# Altium schematic sheet bms_EMBEDDED_R00.SchDoc: Sistema Embebido
size A4; Author: Tobias Bavasso Piizzi; CompanyName: Introducción al Diseño de Circuitos Impresos; Organization: UTN FRBA; Revision: R00
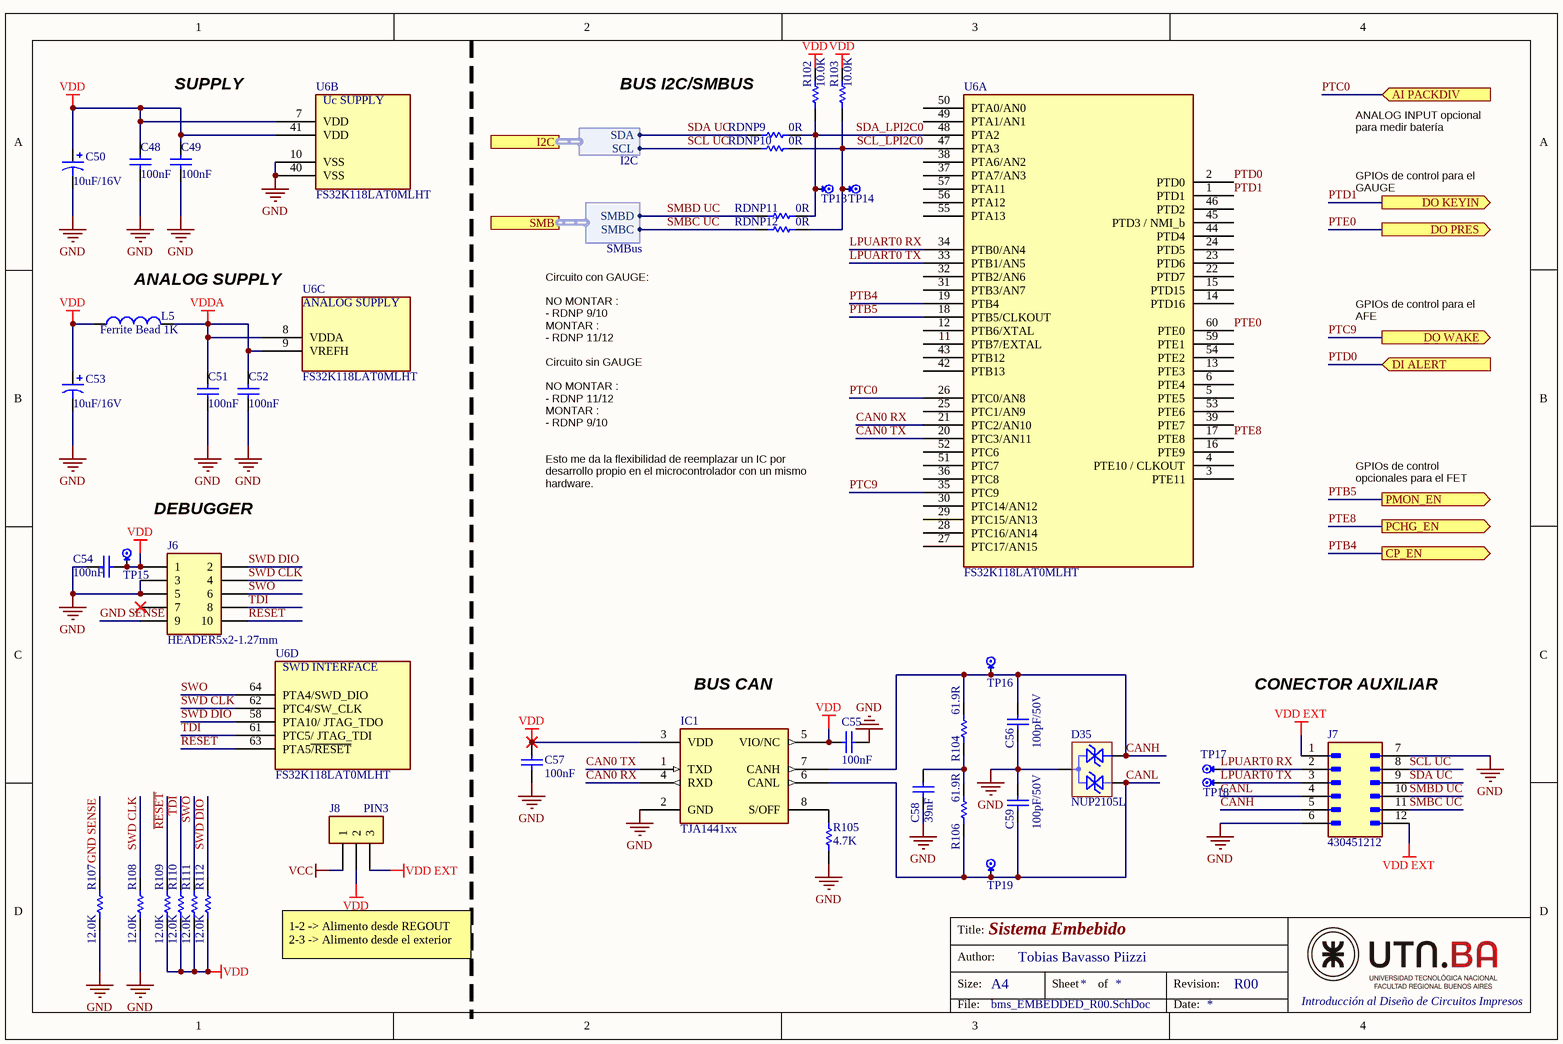
[diagram p0: bms_EMBEDDED_R00.SchDoc]

## Parts
C48  100nF  [C0603]
C49  100nF  [C0603]
C50  10uF/16V  [1206 Cap Tant]
C51  100nF  [C0603]
C52  100nF  [C0603]
C53  10uF/16V  [1206 Cap Tant]
C54  100nF  [C0603]
C55  100nF  [C0603]
C56  100pF/50V  [C0603]
C57  100nF  [C0603]
C58  39nF  [C0603]
C59  100pF/50V  [C0603]
D35  NUP2105L  [SOT-23]
IC1  TJA1441xx  [SOIC8]
J6  HEADER5x2-1.27mm  [PAD10-2X05-HH]
J7  430451212  [MOLEX_430451212]
J8  PIN3  [SIP3]
L5  Ferrite Bead 1K  [0603 FB]
R102  10.0K  [R0603]
R103  10.0K  [R0603]
R104  61.9R  [R0603]
R105  4.7K  [R0603]
R106  61.9R  [R0603]
R107  12.0K  [R0603]
R108  12.0K  [R0603]
R109  12.0K  [R0603]
R110  12.0K  [R0603]
R111  12.0K  [R0603]
R112  12.0K  [R0603]
RDNP9  0R  [R0603]
RDNP10  0R  [R0603]
RDNP11  0R  [R0603]
RDNP12  0R  [R0603]
TP13  Test Point  [TEST POINT SMD 1]  (value not drawn)
TP14  Test Point  [TEST POINT SMD 1]  (value not drawn)
TP15  Test Point  [TEST POINT SMD 1]  (value not drawn)
TP16  Test Point  [TEST POINT SMD 1]  (value not drawn)
TP17  Test Point  [TEST POINT SMD 1]  (value not drawn)
TP18  Test Point  [TEST POINT SMD 1]  (value not drawn)
TP19  Test Point  [TEST POINT SMD 1]  (value not drawn)
U6  FS32K118LAT0MLHT  [LQFP64-NXP]  (parts A,B,C,D of 4)

## Ports
AI PACKDIV (in), CP_EN (out), DI ALERT (in), DO KEYIN (out), DO PRES (out), DO WAKE (out), I2C (harness I2C), PCHG_EN (out), PMON_EN (out), SMB (harness SMBus)

## Harnesses
I2C: SDA, SCL
SMBus: SMBD, SMBC

## Nets
GND: C48.1 C49.1 C50.2 C51.1 C52.1 C53.2 C54.1 C55.1 C56.1 C57.2 C58.1 C59.2 D35.3 IC1.2(GND) J6.3 J6.5 J7.6 J7.7 R105.1 R107.2 R108.2 U6.10(VSS) U6.40(VSS)
VCC: J8.1
VDD: C48.2 C49.2 C50.1 C53.1 C54.2 C55.2 C57.1 IC1.3(VDD) IC1.5(VIO/NC) J6.1 J8.2 L5.1 R102.1 R103.1 R109.2 R110.2 R111.2 R112.2 TP15.1 U6.7(VDD) U6.41(VDD)
VDD EXT: J7.1 J7.12 J8.3
VDDA: C51.2 C52.2 L5.2 U6.8(VDDA) U6.9(VREFH)
~{RESET}: J6.10 R109.1 U6.63(PTA5~{/RESET})
CAN0 RX: IC1.4(RXD) U6.21(PTC2/AN10)
CAN0 TX: IC1.1(TXD) U6.20(PTC3/AN11)
CANH: C56.2 D35.1 IC1.7(CANH) J7.5 R104.2 TP16.1
CANL: C59.1 D35.2 IC1.6(CANL) J7.4 R106.1 TP19.1
GND SENSE: J6.9 R107.1
LPUART0 RX: J7.2 TP17.1 U6.34(PTB0/AN4)
LPUART0 TX: J7.3 TP18.1 U6.33(PTB1/AN5)
PTB4: U6.19(PTB4) ; port CP_EN
PTB5: U6.18(PTB5/CLKOUT) ; port PMON_EN
PTC0: U6.26(PTC0/AN8) ; port AI PACKDIV
PTC9: U6.35(PTC9) ; port DO WAKE
PTD0: U6.2(PTD0) ; port DI ALERT
PTD1: U6.1(PTD1) ; port DO KEYIN
PTE0: U6.60(PTE0) ; port DO PRES
PTE8: U6.17(PTE8) ; port PCHG_EN
SCL UC: J7.8 RDNP10.1 ; port I2C.SCL
SCL_LPI2C0: R103.2 RDNP10.2 RDNP12.2 TP14.1 U6.47(PTA3)
SDA UC: J7.9 RDNP9.1 ; port I2C.SDA
SDA_LPI2C0: R102.2 RDNP9.2 RDNP11.2 TP13.1 U6.48(PTA2)
SMBC UC: J7.11 RDNP12.1 ; port SMB.SMBC
SMBD UC: J7.10 RDNP11.1 ; port SMB.SMBD
SWD CLK: J6.4 R108.1 U6.62(PTC4/SW_CLK)
SWD DIO: J6.2 R112.1 U6.58(PTA10/_JTAG_TDO)
SWO: J6.6 R111.1 U6.64(PTA4/SWD_DIO)
TDI: J6.8 R110.1 U6.61(PTC5/_JTAG_TDI)
NetC58_2: C58.2 R104.1 R106.2
NetIC1_8: IC1.8(S/OFF) R105.2

Not connected (* = marked no-connect by the designer): J6 7*; U6 3(PTE11) 4(PTE10_/_CLKOUT) 5(PTE5) 6(PTE4) 11(PTB7/EXTAL) 12(PTB6/XTAL) 13(PTE3) 14(PTD16) 15(PTD15) 16(PTE9) 22(PTD7) 23(PTD6) 24(PTD5) 25(PTC1/AN9) 27(PTC17/AN15) 28(PTC16/AN14) 29(PTC15/AN13) 30(PTC14/AN12) 31(PTB3/AN7) 32(PTB2/AN6) 36(PTC8) 37(PTA7/AN3) 38(PTA6/AN2) 39(PTE7) 42(PTB13) 43(PTB12) 44(PTD4) 45(PTD3_/_NMI_b) 46(PTD2) 49(PTA1/AN1) 50(PTA0/AN0) 51(PTC7) 52(PTC6) 53(PTE6) 54(PTE2) 55(PTA13) 56(PTA12) 57(PTA11) 59(PTE1)

## Notes on the sheet
- SUPPLY
- BUS I2C/SMBUS
- ANALOG INPUT opcional para medir batería
- GPIOs de control para el GAUGE
- (near L5) ANALOG SUPPLY
- GPIOs de control para el AFE
- DEBUGGER
- Circuito con GAUGE:
  NO MONTAR :
  - RDNP 9/10
  MONTAR :
  - RDNP 11/12
  Circuito sin GAUGE
  NO MONTAR :
  - RDNP 11/12
  MONTAR :
  - RDNP 9/10
  Esto me da la flexibilidad de reemplazar un IC por desarrollo propio en el microcontrolador con un mismo hardware.
- GPIOs de control opcionales para el FET
- (near IC1) BUS CAN
- CONECTOR AUXILIAR
- 1-2 -> Alimento desde REGOUT
  2-3 -> Alimento desde el exterior
- Title:
- Size:
- Author:
- A4
- Sheet
- of
- Revision:
- File:
- Date:
- (in symbol FS32K118LAT0MLHT, part B) Uc SUPPLY
- (in symbol FS32K118LAT0MLHT, part C) ANALOG SUPPLY
- (in symbol FS32K118LAT0MLHT, part D) SWD INTERFACE

## Library data of the parts
C48 C49 C51 C52 C54-C59 = Cap 0603: Capacitor
C50 C53 = Cap Pol Tantalio: Polarized Capacitor Tantalium
D35 = NUP2105L: Dual Line CAN Bus Protector TVS DIODE 24VWM 44VC SOT23-3
IC1 = TJA1441xx: High-speed CAN transceiver
J6 = HEADER5x2-1.27mm: PAD10-2X05-HH
J7 = 430451212: Micro-Fit 3.0 43045 / CONN HEADER VERT 12POS 3MM; MP: 430451012; Price: None; Availability: Unavailable; Value: *; Package: None
L5 = BLM18KG102SN1D: BLM18KG102SN1D 1K
R102-R112 RDNP9-RDNP12 = Res: Resistor
U6 = FS32K118LAT0MLHT: ARM® Cortex®-M0+ series Microcontroller IC 32-Bit Single-Core 48MHz 256KB (256K x 8) FLASH 64-LQFP (10x10)